# Altium project POWER-CONNECTOR.PrjPcb
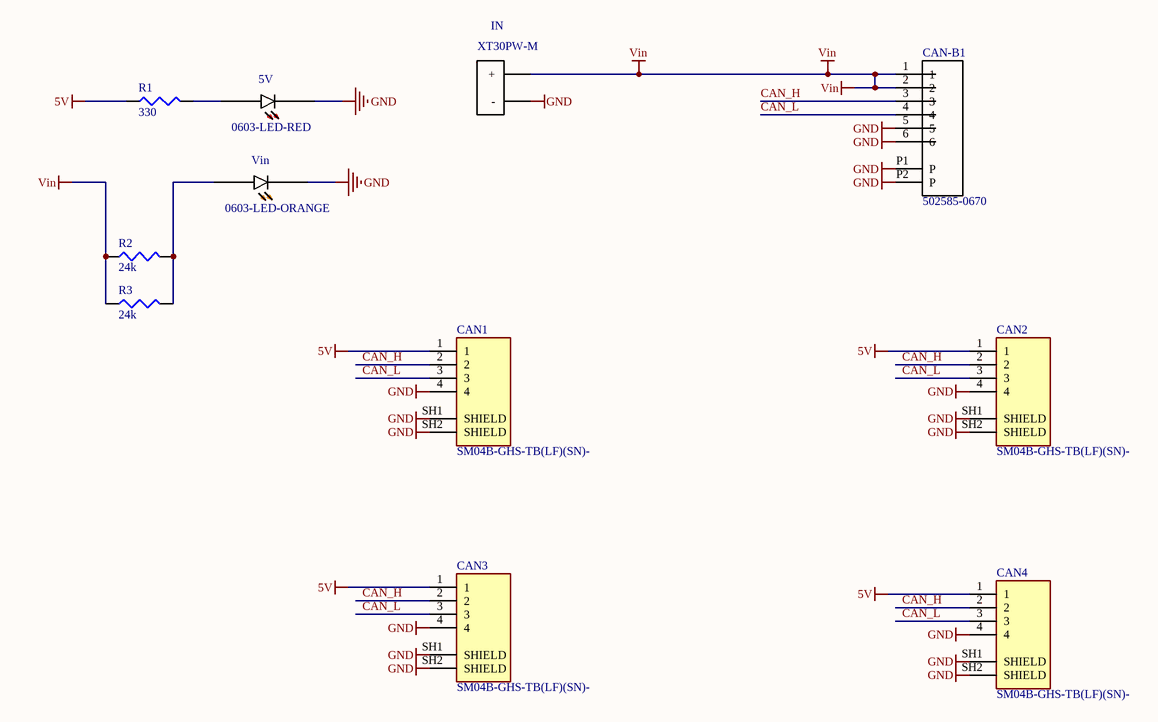
[diagram p0: CAN MUX.SchDoc]
Version: 1.3
1 sheet, 11 parts. Net scope: global (net labels, ports and power ports of the same name join across sheets).
Board file: PCB.PcbDoc

## Sheet CAN MUX.SchDoc
size A4

### Parts
5V  0603-LED-RED  [*LEDM1608X80_LTE-C1906R-14(Primary)]
CAN1  SM04B-GHS-TB(LF)(SN)-  [JST_SM04B-GHS-TB(LF)(SN)-]
CAN2  SM04B-GHS-TB(LF)(SN)-  [JST_SM04B-GHS-TB(LF)(SN)-]
CAN3  SM04B-GHS-TB(LF)(SN)-  [JST_SM04B-GHS-TB(LF)(SN)-]
CAN4  SM04B-GHS-TB(LF)(SN)-  [JST_SM04B-GHS-TB(LF)(SN)-]
CAN-B1  502585-0670  [MOLEX_502585-0670]
IN  XT30PW-M  [XT30PW-M]
R1  value 330  [J1-0603]  (hidden comment: RC0603FR-07330RL)
R2  value 24k  [J1-0603]  (hidden comment: RC0603FR-0724KL)
R3  value 24k  [J1-0603]  (hidden comment: RC0603FR-0724KL)
Vin  0603-LED-ORANGE  [*LEDM1608X80_LTE-C1906R-14(Primary)]

### Nets
5V: CAN1.1 CAN2.1 CAN3.1 CAN4.1 R1.1
GND: 5V.C CAN1.4 CAN1.SH1(SHIELD) CAN1.SH2(SHIELD) CAN2.4 CAN2.SH1(SHIELD) CAN2.SH2(SHIELD) CAN3.4 CAN3.SH1(SHIELD) CAN3.SH2(SHIELD) CAN4.4 CAN4.SH1(SHIELD) CAN4.SH2(SHIELD) CAN-B1.5 CAN-B1.6 CAN-B1.P1(P) CAN-B1.P2(P) IN.MINUS(-) Vin.C
Vin: CAN-B1.1 CAN-B1.2 IN.PLUS(+) R2.1 R3.1
CAN_H: CAN1.2 CAN2.2 CAN3.2 CAN4.2 CAN-B1.3
CAN_L: CAN1.3 CAN2.3 CAN3.3 CAN4.3 CAN-B1.4
Net5V_A: 5V.A R1.2
NetR2_2: R2.2 R3.2 Vin.A

### Library data of the parts
5V = 0603-LED-RED: Red 620nm LED Indication - Discrete 2.2V 0603 (1608 Metric); MP: LTST-C194KRKT; Package: 0603 Lite-On; SnapEDA_Link: https://www.snapeda.com/parts/LTE-C1906R-14/Lite-On%20Inc./view-part/?ref=snap; Value: RED; Type: SMD
CAN1-CAN4 = SM04B-GHS-TB(LF)(SN)-: Connector Header Surface Mount, Right Angle 4 position 0.049 _1.25mm_; MP: SM04B-GHS-TB_LF__SN_-; MF: JST Sales; Package: None; Value: *; Price: None; SnapEDA_Link: https://www.snapeda.com/parts/SM04B-GHS-TB%28LF%29%28SN%29-/JST%20Sales%20America%20Inc./view-part/2759740/?ref=snap; HelpURL: http://www.farnell.com/datasheets/2082975.pdf; System: Connector; ChipDip_Link: https://www.chipdip.ru/product/sm04b-ghs-tb-lf-sn-gh-1.25mm-header-side-ent; Type: SMD
CAN-B1 = 502585-0670: 1.50mm Pitch, CLIK-Mate PCB Receptacle, Single Row, Surface Mount, Right-Angle, Tin Plating, Positive Lock, 6 Circuits, Natural; MF: Molex; System: Connector; MP: 502585-0670; Package: None; SnapEDA_Link: https://www.snapeda.com/parts/502494-0670/Molex/view-part/?ref=snap; Price: None; Value: *; Type: SMD
IN = XT30PW-M: MF: AMASS; Package: Package Analog Devices; MP: XT30PW-M; SnapEDA_Link: https://www.snapeda.com/parts/XT60-M/AMASS/view-part/?ref=snap; Price: None; Value: *; Type: SMT
R1 = RC0603FR-07330RL: 330 Ohms ±1% 0.1W, 1/10W Chip Resistor 0603 (1608 Metric) Thick Film; MF: Yageo or NXP; ChipDip_Link: https://www.chipdip.ru/product0/9000079628; HelpURL: https://www.yageo.com/upload/media/product/productsearch/datasheet/rchip/PYu-RC_Group_51_RoHS_L_10.pdf; Package: R0603; Type: SMD; MP: RC0603FR-07330RL; SnapEDA_Link: https://www.snapeda.com/parts/RC0603FR-07330RL/Yageo/view-part/?ref=search&t=RC0603FR-07330RL
R2 R3 = RC0603FR-0724KL: 24 kOhms ±1% 0.1W, 1/10W Chip Resistor 0603 (1608 Metric) Thick Film; MF: Yageo or NXP; ChipDip_Link: https://www.chipdip.ru/product0/9000079736; HelpURL: https://www.yageo.com/upload/media/product/productsearch/datasheet/rchip/PYu-RC_Group_51_RoHS_L_10.pdf; Package: R0603; Type: SMD; MP: RC0603FR-0724KL; SnapEDA_Link: https://www.snapeda.com/parts/RC0603FR-074K7L/Yageo/view-part/?ref=dk&t=RC0603FR-074K7L&con_ref=None
Vin = 0603-LED-ORANGE: Orange 605nm LED Indication - Discrete 2.2V 0603 (1608 Metric); MP: LTST-C194KFKT; Package: 0603 Lite-On; SnapEDA_Link: https://www.snapeda.com/parts/SML-D12D1WT86/Rohm/view-part/?ref=search&t=0603%20LED%20orange; Value: ORANGE; Type: SMD